# EAGLE design Controller-II (EAGLE 7.2.0)
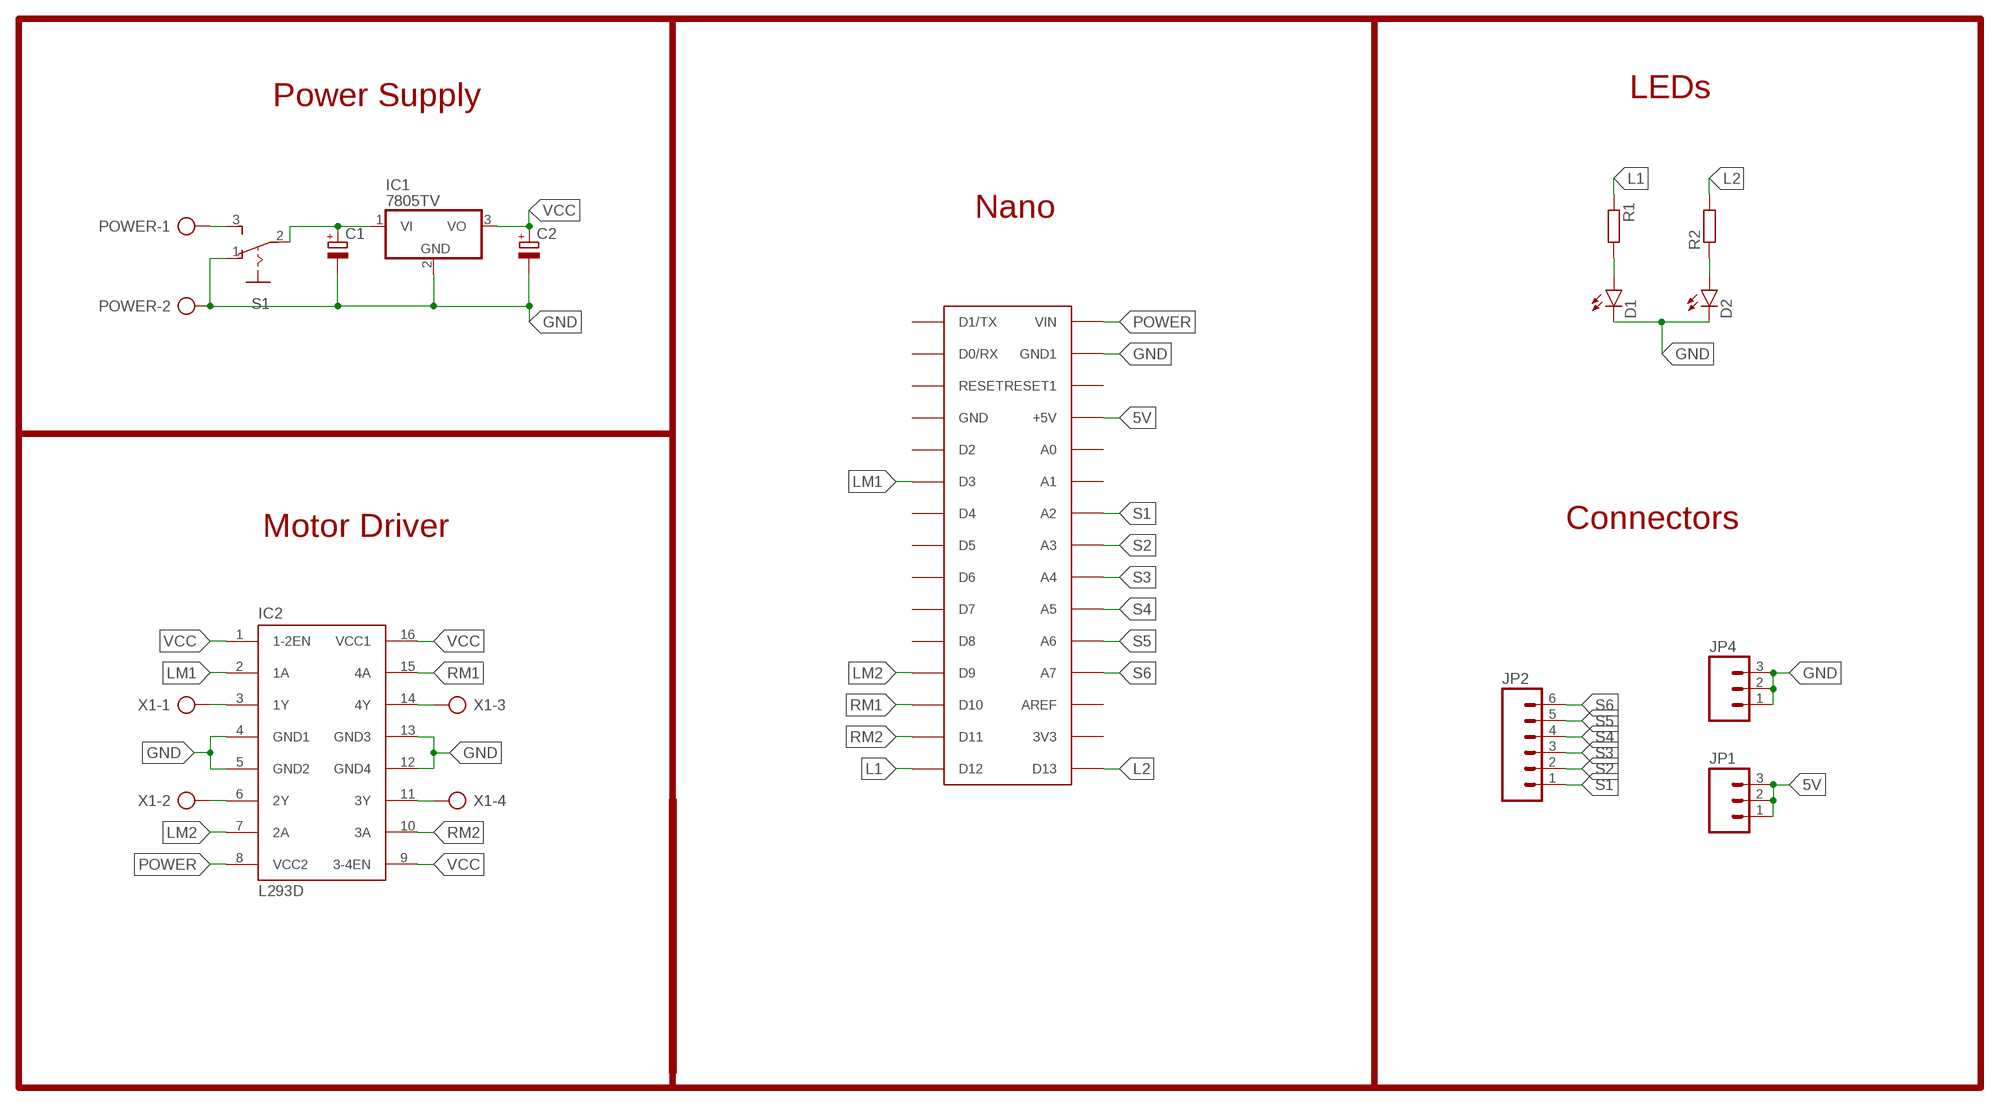
[diagram p0: schematic, sheet 1]

## Parts
C1  CPOL-EUE5-10.5  [E5-10,5]
C2  CPOL-EUE5-10.5  [E5-10,5]
D1  LED5MM  [LED5MM]
D2  LED5MM  [LED5MM]
IC1  7805TV  [TO220V]
IC2  L293D  [DIL16]
JP1  M031X03_NO_SILK  [1X03_NO_SILK]
JP2  M06NO_SILK_FEMALE_PTH  [1X06_NO_SILK]
JP4  M031X03_NO_SILK  [1X03_NO_SILK]
POWER  AK300/2  [AK300/2]
R1  R-EU_0204/5  [0204/5]
R2  R-EU_0204/5  [0204/5]
S1  255SB  [255SB]
U1  ARDUINONANO  [PDIP-32]
X1  AK300/4  [AK300/4]

## Nets
5V: JP1.1 JP1.2 JP1.3 U1.+5V
7805: C1.+ IC1.1(VI) S1.2(P)
GND: C1.- C2.- D1.K(C) D2.K(C) IC1.2(GND) IC2.4(GND1) IC2.5(GND2) IC2.12(GND4) IC2.13(GND3) JP4.1 JP4.2 JP4.3 POWER.2 S1.1(O) U1.GND1
L1: R1.1 U1.D12
L2: R2.2 U1.D13
L02: IC2.6(2Y) X1.2
LM1: IC2.2(1A) U1.D3
LM2: IC2.7(2A) U1.D9
LO1: IC2.3(1Y) X1.1
N$1: D1.A R1.2
N$2: D2.A R2.1
POWER: IC2.8(VCC2) POWER.1 S1.3(S) U1.VIN
R01: IC2.14(4Y) X1.3
R02: IC2.11(3Y) X1.4
RM1: IC2.15(4A) U1.D10
RM2: IC2.10(3A) U1.D11
S1: JP2.1 U1.A2
S2: JP2.2 U1.A3
S3: JP2.3 U1.A4
S4: JP2.4 U1.A5
S5: JP2.5 U1.A6
S6: JP2.6 U1.A7
VCC: C2.+ IC1.3(VO) IC2.1(1-2EN) IC2.9(3-4EN) IC2.16(VCC1)
Unconnected: U1.3V3 U1.A0 U1.A1 U1.AREF U1.D0/RX U1.D1/TX U1.D2 U1.D4 U1.D5 U1.D6 U1.D7 U1.D8 U1.GND U1.RESET U1.RESET1

## Notes on the sheet
- Power Supply
- LEDs
- Nano
- Motor Driver
- Connectors

## Library data of the parts
C1 C2 = rcl:CPOL-EU: POLARIZED CAPACITOR, European symbol
D1 D2 = SparkFun-LED:LED: LEDs Standard schematic elements and footprints for 5mm, 3mm, 1206, and 0603 sized LEDs. 5mm - Spark Fun Electronics SKU : COM-00529 (and others)
IC1 = linear:78*: Positive VOLTAGE REGULATOR Source: http://cache.national.com/ds/LM/LM78L05.pdf http://www.fairchildsemi.com/ds/LM/LM7805.pdf
IC2 = st-microelectronics:L293D: PUSH-PULL 4 CHANNEL DRIVER; MPN: L293D; OC_FARNELL: 9589619; OC_NEWARK: 56P8249
JP1 JP4 = SparkFun-Connectors:M03: Header 3 Standard 3-pin 0.1" header. Use with straight break away headers (SKU : PRT-00116), right angle break away headers (PRT-00553), swiss pins (PRT-00743), machine pins (PRT-00117), and female headers (PRT-00115). Molex polarized connector foot print use with SKU : PRT-08232 with associated crimp pins and housings.
JP2 = SparkFun-Connectors:M06: Header 6 Standard 6-pin 0.1" header. Use with straight break away headers (SKU : PRT-00116), right angle break away headers (PRT-00553), swiss pins (PRT-00743), machine pins (PRT-00117), and female headers (PRT-00115). Molex polarized connector foot print use with SKU : PRT-08094 with associated crimp pins and housings. NOTES ON THE VARIANTS LOCK and LOCK_LONGPADS... This footprint was designed to help hold the alignment of a through-hole component (i.e. 6-pin header) while soldering it into place. You may notice that each hole has been shifted either up or down by 0.005 of an inch from it's more standard position (which is a perfectly straight line). This slight alteration caused the pins (the squares in the middle) to touch the edges of the holes. Because they are alternating, it causes a "brace" to hold the component in place. 0.005 has proven to be the perfect amount of "off-center" position when using our standard breakaway headers. Although looks a little odd when you look at the bare footprint, once you have a header in there, the alteration is very hard to notice. Also,if you push a header all the way into place, it is covered up entirely on the bottom side. This idea of altering the position of holes to aid alignment will be further integrated into the Sparkfun Library for other footprints. It can help hold any component with 3 or more connection pins.; PROD_ID: CONN-08437
POWER = con-ptr500:AK300/2: CONNECTOR; OC_FARNELL: unknown; OC_NEWARK: unknown
R1 R2 = rcl:R-EU_: RESISTOR, European symbol
S1 = switch:255SB: SLIDING SWITCH Distributor Buerklin, 11G810
U1 = rocketfarm:ARDUINONANO
X1 = con-ptr500:AK300/4: CONNECTOR; OC_FARNELL: unknown; OC_NEWARK: unknown

## Board
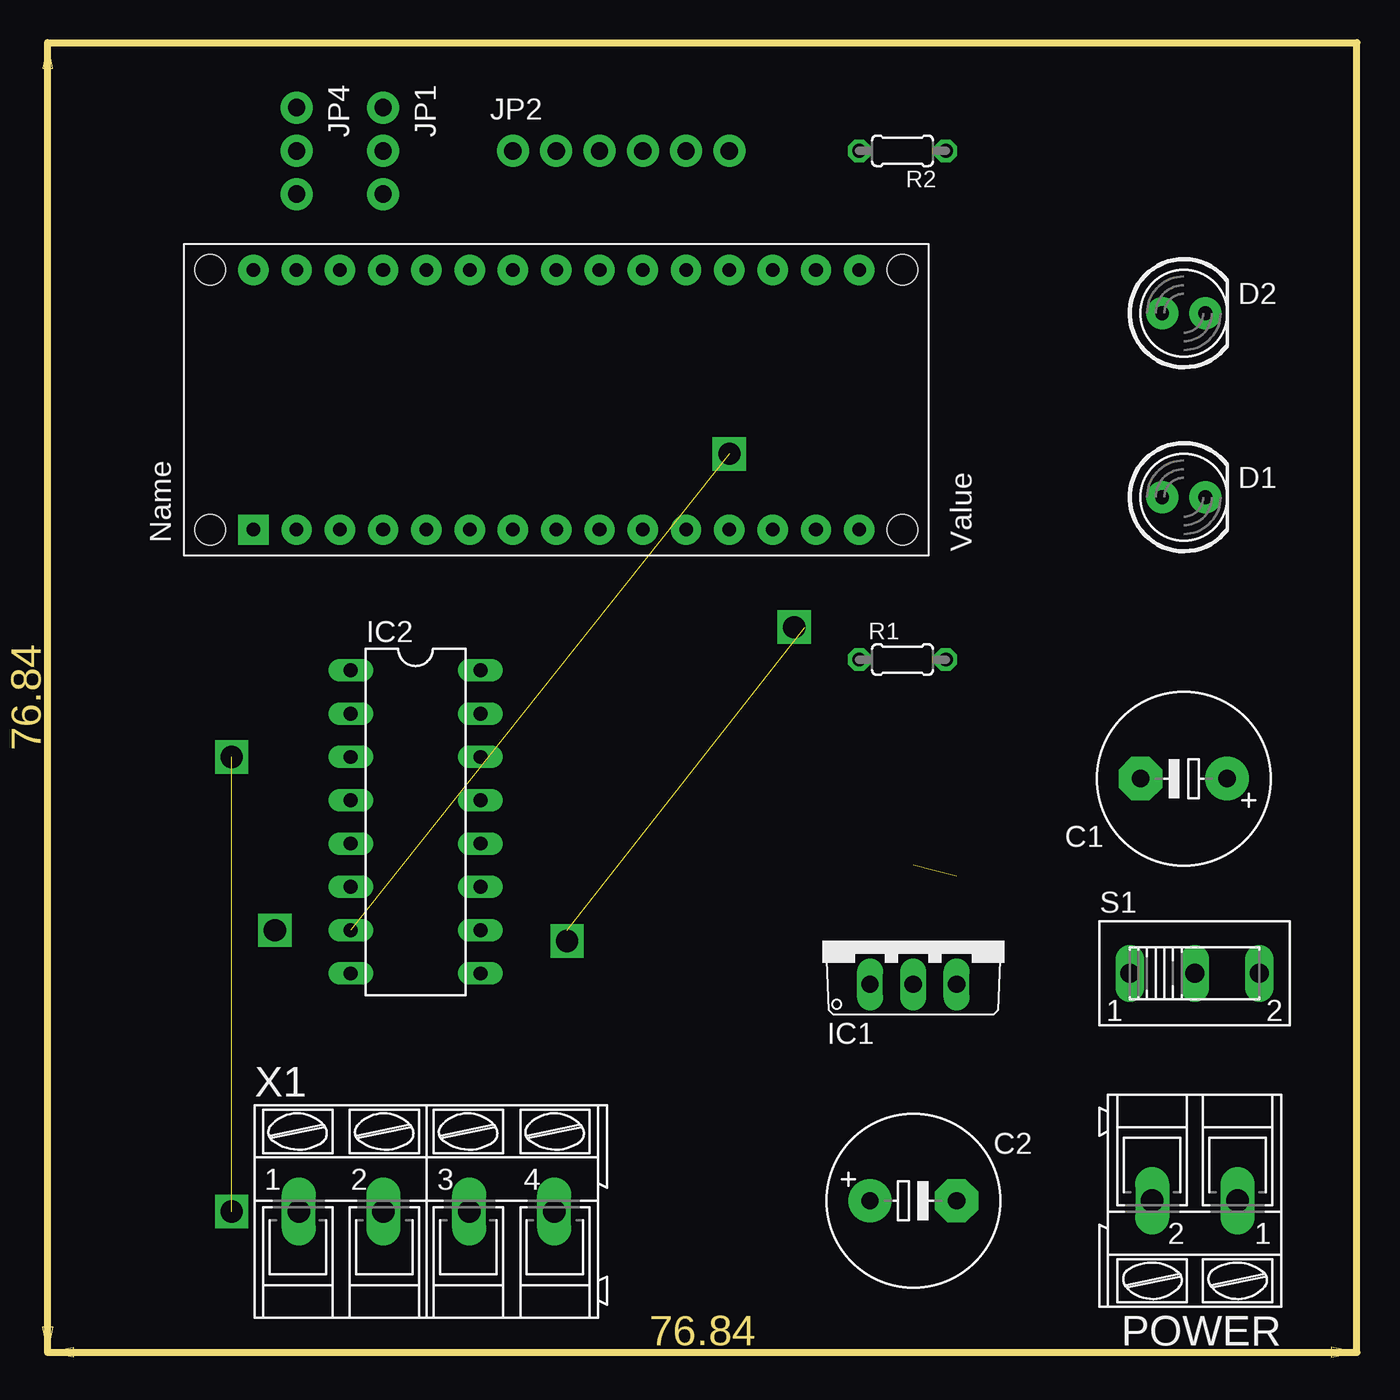
[diagram p1: board, top side]
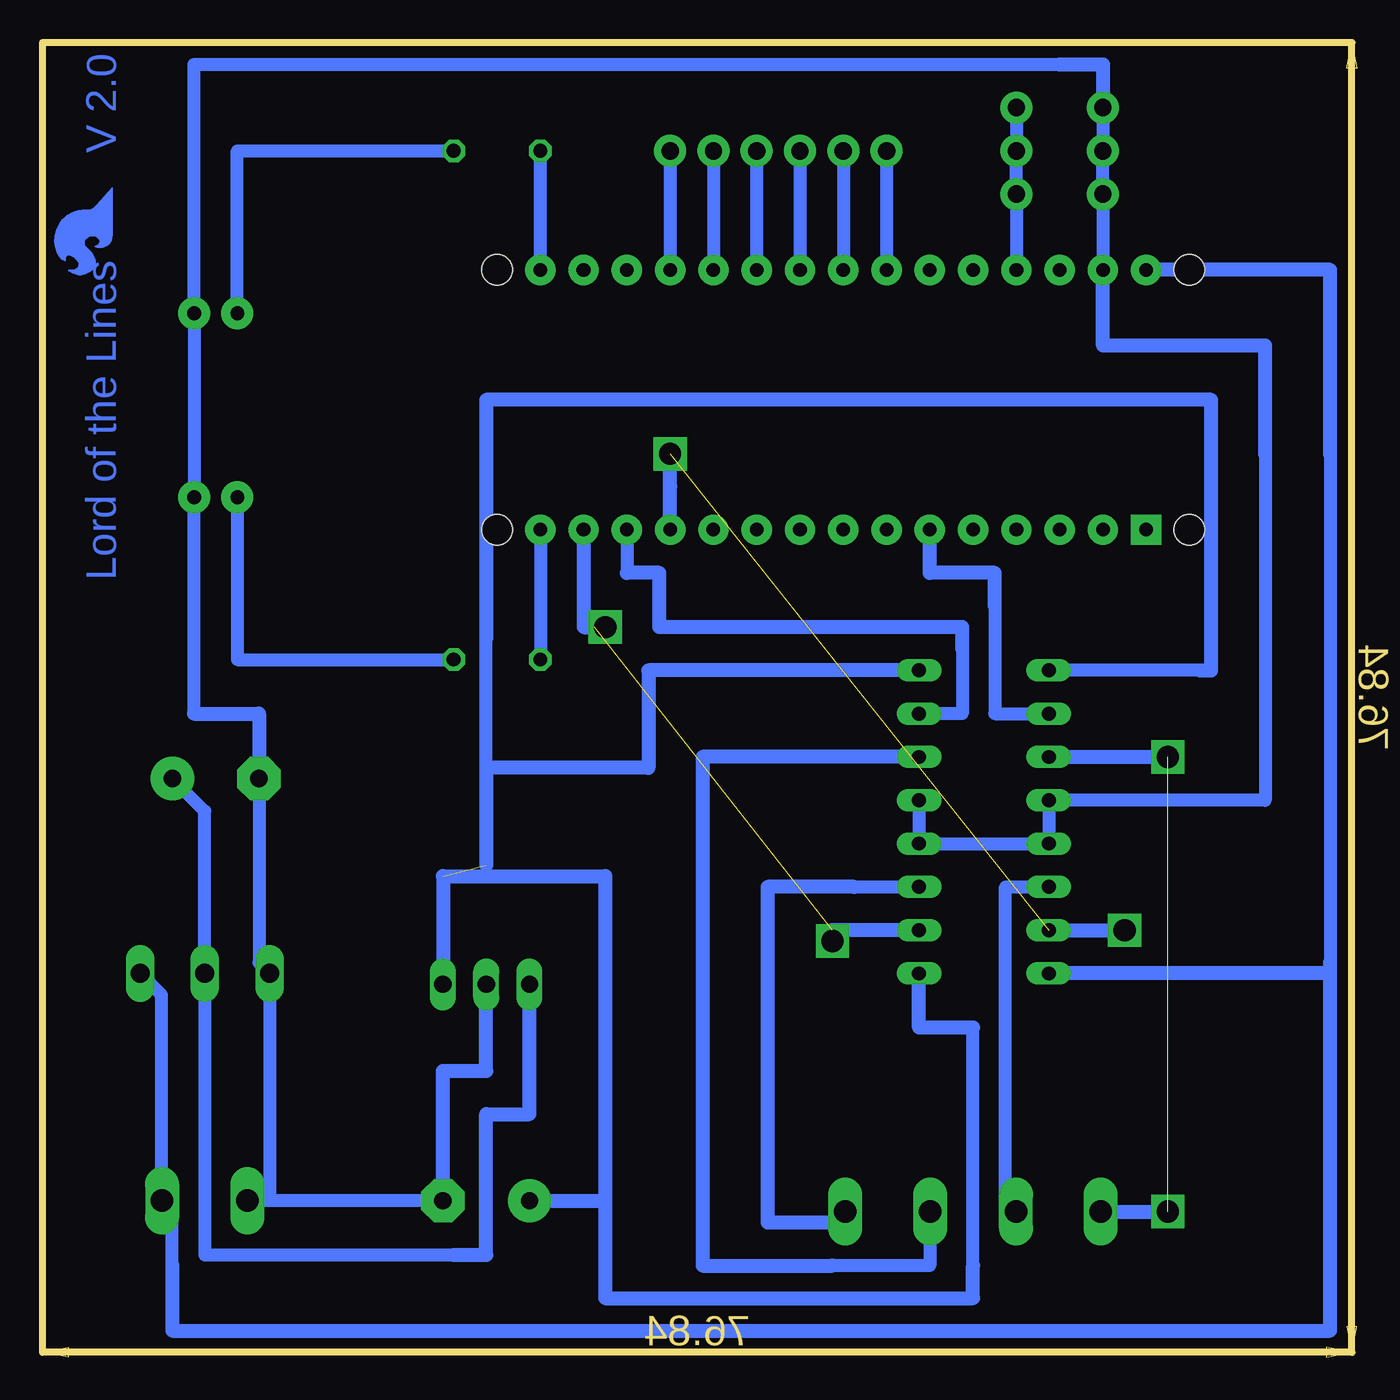
[diagram p2: board, bottom side, seen from below]

Size 76.84 x 76.84 mm. Coordinates in mm from the lower left corner, seen from the top.
Outline: 0,0 76.84,0 76.84,76.84 0,76.84 0,0
Copper layers (1*16): Top 0.035mm / dielectric 1.5mm / Bottom 0.035mm
Design rules "default *": minimum track width 30mil, minimum drill 24mil, track to track 30mil, track to pad 30mil, pad to pad 30mil, via to via 30mil, smd to smd 30mil, copper to edge 40mil, drill to drill 8mil, minimum pad ring 10mil, minimum via ring 8mil, stop-mask expansion 4mil, vias tented up to drill 0mil, thermal gap 10mil

### Footprints (pad centres in the part's own frame; a part is rotated, then mirrored left to right if it is on the bottom)
E5-10,5 = drill 1.016 pad 2.54: + -2.54,0 | drill 1.016 pad 2.54 octagon: - 2.54,0
LED5MM = drill 0.813 pad 1.88: A -1.27,0; K 1.27,0
TO220V = drill 1.016 long: 1 -2.54,-2.54; 2 0,-2.54; 3 2.54,-2.54
DIL16 = drill 0.813 long: 1 -8.89,-3.81; 2 -6.35,-3.81; 3 -3.81,-3.81; 4 -1.27,-3.81; 5 1.27,-3.81; 6 3.81,-3.81; 7 6.35,-3.81; 8 8.89,-3.81; 9 8.89,3.81; 10 6.35,3.81; 11 3.81,3.81; 12 1.27,3.81; 13 -1.27,3.81; 14 -3.81,3.81; 15 -6.35,3.81; 16 -8.89,3.81
1X03_NO_SILK = drill 1.016 pad 1.88: 1 0,0; 2 2.54,0; 3 5.08,0
1X06_NO_SILK = drill 1.016 pad 1.88: 1 0,0; 2 2.54,0; 3 5.08,0; 4 7.62,0; 5 10.16,0; 6 12.7,0
AK300/2 = drill 1.321 long: 1 -2.515,0; 2 2.489,0
0204/5 = drill 0.813 octagon: 1 -2.54,0; 2 2.54,0
255SB = drill 1.118 long: 1 -3.81,0; 2 0,0; 3 3.81,0
PDIP-32 = drill 0.8 pad 1.778: 3V3 15.24,-35.56; +5V 15.24,-10.16; A0 15.24,-12.7; A1 15.24,-15.24; A2 15.24,-17.78; A3 15.24,-20.32; A4 15.24,-22.86; A5 15.24,-25.4; A6 15.24,-27.94; A7 15.24,-30.48; AREF 15.24,-33.02; D0/RX 0,-5.08; D2 0,-12.7; D3 0,-15.24; D4 0,-17.78; D5 0,-20.32; D6 0,-22.86; D7 0,-25.4; D8 0,-27.94; D9 0,-30.48; D10 0,-33.02; D11 0,-35.56; D12 0,-38.1; D13 15.24,-38.1; GND 0,-10.16; GND1 15.24,-5.08; RESET 0,-7.62; RESET1 15.24,-7.62; VIN 15.24,-2.54 | drill 0.8 pad 1.778 square: D1/TX 0,-2.54 | hole 1.778: 0,0; 0,-40.64; 15.24,-40.64; 15.24,0
AK300/4 = drill 1.321 long: 1 -7.493,0; 2 -2.515,0; 3 2.515,0; 4 7.493,0

### Placement (x,y rotation side)
C1  66.68,33.65 180 top
C2  50.8,8.89 0 top
D1  66.68,50.16 0 top
D2  66.68,60.96 0 top
IC1  50.8,24.13 0 top
IC2  21.59,31.11 270 top
JP1  19.68,73.03 270 top
JP2  27.3,70.48 0 top
JP4  14.6,73.03 270 top
POWER  67.31,8.89 180 top
R1  50.16,40.64 0 top
R2  50.16,70.48 180 top
S1  67.31,22.23 0 top
U1  9.52,48.26 90 top
U$1  [SFE_LOGO_FLAME_COPPER_.2]  72.39,68.58 180 bottom
X1  22.23,8.26 0 top

### Tracks (layer width: path | path; a pad name or v marks a point on that pad's centre or on a via)
5V
  Bottom 0.762: JP1.1 JP1.2 JP1.3 U1.+5V
7805
  Bottom 0.762: 52.71,5.71 67.31,5.71 S1.2 67.31,31.75 C1.+
  Bottom 0.813: 52.71,5.71 50.8,5.71 50.8,13.97 48.26,13.97 IC1.1
GND
  Bottom 0.762: IC2.13 IC2.12 IC2.5 IC2.4 5.08,32.38 5.08,52.7 | JP4.1 JP4.2 JP4.3 U1.GND1 14.6,62.87 14.6,62.23 | 53.34,10.16 C2.- 63.5,8.89 | 63.5,8.89 POWER.2 | C1.- 64.13,22.86 S1.1 63.5,8.89 | 67.94,37.46 D1.K D2.K 67.94,75.56 17.15,75.56
  Bottom 0.813: 5.08,52.7 5.08,59.05 14.6,59.05 14.6,62.87 | 53.34,10.16 53.34,16.51 50.8,16.51 IC1.2 | 17.15,75.56 14.6,75.56 JP4.1 | 67.94,37.46 64.13,37.46 C1.-
L1
  Bottom 0.762: U1.D12 R1.1
L2
  Bottom 0.762: U1.D13 R2.2
L02
  Bottom 0.762: IC2.6 20.32,27.3 20.32,8.26 X1.2
LM1
  Bottom 0.762: IC2.2 20.96,37.46 20.96,43.81 | U1.D3 24.77,47.62
  Bottom 0.813: 20.96,43.81 20.96,45.72 24.77,45.72 24.77,47.62
LM2  (1 unrouted)
  Bottom 0.813: IC2.7 13.34,24.77 | 40.01,50.8 U1.D9 40.01,52.7
LO1  (1 unrouted)
  Bottom 0.813: IC2.3 10.79,34.92 | X1.1 10.79,8.26
N$1
  Bottom 0.762: R1.2 65.41,40.64 D1.A
N$2
  Bottom 0.762: R2.1 65.41,70.48 D2.A
N$3  (via drill 1.3)
  other vias: 30.48,24.13
N$4  (via drill 1.3)
  other vias: 43.82,42.54
N$5  (via drill 1.3)
  other vias: 10.79,8.26
N$6  (via drill 1.3)
  other vias: 10.79,34.92
N$7  (via drill 1.3)
  other vias: 13.34,24.77
N$8  (via drill 1.3)
  other vias: 40.01,52.7
POWER
  Bottom 0.762: S1.3 69.85,20.96 69.85,8.89 POWER.1 69.22,8.89 69.22,5.08 | 1.27,52.7 1.27,22.86 1.27,22.23
  Bottom 0.813: 69.22,5.08 69.22,1.27 1.27,1.27 1.27,22.86 | 1.27,22.23 IC2.8 | U1.VIN 1.27,63.5 1.27,52.7
R01
  Bottom 0.762: 31.12,5.08 30.48,5.08 24.77,5.08 24.77,8.26 X1.3
  Bottom 0.813: IC2.14 38.1,34.92 38.1,5.08 30.48,5.08
R02
  Bottom 0.762: 29.21,27.3 IC2.11 | 29.21,8.26 X1.4
  Bottom 0.813: 29.21,27.3 34.29,27.3 34.29,7.62 29.72,7.62 X1.4
RM1
  Bottom 0.762: IC2.15 22.86,37.46 22.86,41.27 | U1.D10 42.54,45.72
  Bottom 0.813: 22.86,41.27 22.86,42.54 40.64,42.54 40.64,45.72 42.54,45.72
RM2  (1 unrouted)
  Bottom 0.813: IC2.10 30.48,24.77 30.48,24.13 | U1.D11 45.09,42.54 44.45,42.54
S1
  Bottom 0.762: JP2.1 U1.A2
S2
  Bottom 0.762: JP2.2 U1.A3
S3
  Bottom 0.762: JP2.3 U1.A4
S4
  Bottom 0.762: JP2.4 U1.A5
S5
  Bottom 0.762: JP2.5 U1.A6
S6
  Bottom 0.762: JP2.6 U1.A7
VCC  (1 unrouted)
  Bottom 0.762: 22.23,5.08 22.23,19.05 | 8.89,40 IC2.1 | 50.8,34.29 50.8,41.91 | IC1.3 53.34,22.86
  Bottom 0.813: 50.8,41.91 50.8,55.88 8.26,55.88 8.26,40 8.89,40 | 50.8,28.57 50.8,34.29 41.27,34.29 41.27,40 IC2.16 | IC1.3 53.34,27.94 43.82,27.94 43.82,8.89 | 22.23,5.08 22.23,3.18 43.82,3.18 43.82,8.89 | C2.+ 43.82,8.89 | 22.23,19.05 25.4,19.05 IC2.9

### Text on the board
Bottom: V 2.0 | Lord of the Lines